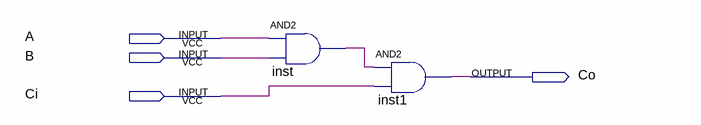
[diagram p0: schematic sheet]
// Quartus schematic igualdade_Bit.bdf as structural Verilog: 2 symbols, 4 pins
module igualdade_Bit (
  input  A,
  input  B,
  input  Ci,
  output Co
);

  wire inst_out;

  and inst (inst_out, A, B);
  and inst1 (Co, inst_out, Ci);
endmodule
